# Altium schematic sheet Interface.SchDoc: Interface
size A3; Organization: Hofmann Travel; SheetNumber: 4; SheetTotal: 10
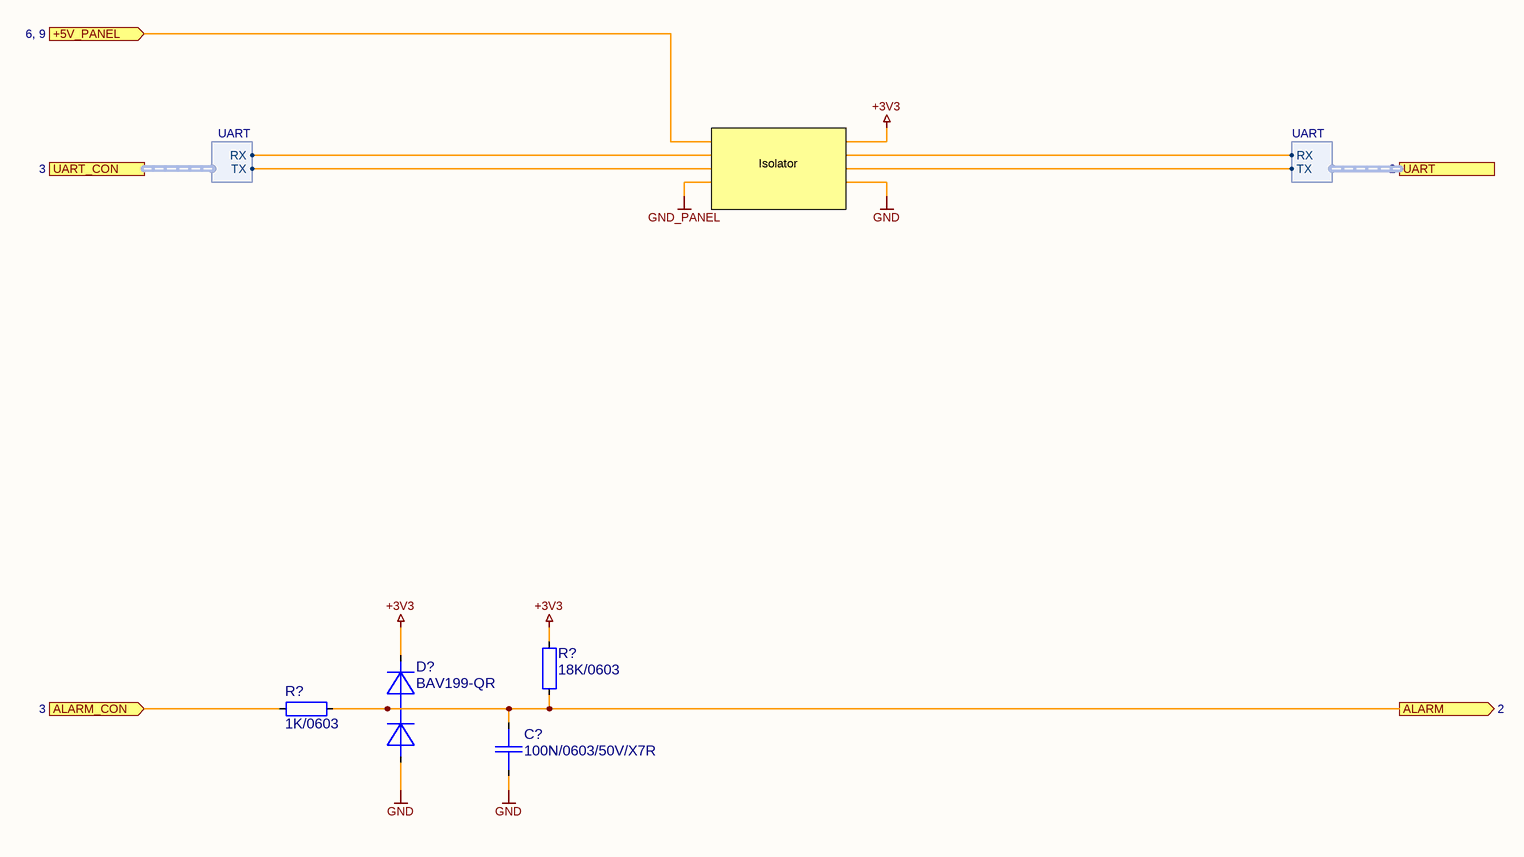
[diagram p0: Interface.SchDoc]

## Parts
(Parts that share a designator on the sheet are numbered #1, #2 ... from top to bottom, then left to right.)
C?  100N/0603/50V/X7R  [CAP0603_X7R]
D?  BAV199-QR  [SOT2395P280X125-3-SE]
R?#1  18K/0603  [R0603-0.40-WW]
R?#2  1K/0603  [R0603-0.40-WW]

## Ports
+5V_PANEL (in, see 6, 9), ALARM (out, see 2), ALARM_CON (in, see 3), UART (harness UART, see 2), UART_CON (harness UART, see 3)

## Harnesses
UART: RX, TX

## Nets
+3V3: D?.2(K2) R?#1.1
GND: C?.2 D?.1(A1)
ALARM: C?.1 D?.3(K1/A2) R?#1.2 R?#2.2 ; port ALARM
ALARM_CON: R?#2.1 ; port ALARM_CON

## Notes on the sheet
- Isolator
- Date:
- Size:
- A3
- Schema:
- Layout:

## Library data of the parts
C? = 100N/0603/50V/X7R: CAP SM 0603 100nF 50V X7R; Manufacturer: GENERIC; Manufacturer 1: YAGEO; Manufacturer Part Number 1: CC0603KPX7R9BB104; Absolute Value: 1E-7; Eurocircuits GPN: GPC0603104; Part Number: 100N/0603/50V/X7R; Package: 0603; Value: 100nF; HelpURL: https://www.yageo.com/upload/media/product/app/datasheet/mlcc/upy-gphc_x7r_6_3v-to-250v.pdf; Supplier 1: Digi-Key; Supplier Part Number 1: 311-3567-1-ND; Manufacturer 2: YAGEO; Manufacturer Part Number 2: CC0603MRX7R9BB104; Supplier 2: Digi-Key; Supplier Part Number 2: 311-4110-1-ND; Supplier 3: LCSC; Supplier Part Number 3: C14663; JLC Type: Basic
D? = BAV199-QR: Low-leakage double diode; Manufacturer: Nexperia USA Inc.; Absolute Value: 75V; Part Number: BAV199-QR; Package: SOT23; Value: BAV199-QR; HelpURL: https://assets.nexperia.com/documents/data-sheet/BAV199-Q.pdf; Manufacturer 1: Nexperia USA Inc.; Manufacturer Part Number 1: BAV199-QR; Supplier 1: Digikey; Supplier Part Number 1: 1727-BAV199-QRCT-ND; Manufacturer 3: Jiangsu Changjing Electronics Technology Co., Ltd.; Manufacturer Part Number 3: BAV199; Supplier 3: LCSC; Supplier Part Number 3: C68971
R?#1 = 18K/0603: RES SM 0603 18K; Manufacturer: GENERIC; Manufacturer 1: YAGEO; Manufacturer Part Number 1: RC0603FR-1318KL; Absolute Value: 18000; Eurocircuits GPN: GPR060318K; Part Number: 18K/0603; Package: 0603; Value: 18K; HelpURL: https://www.yageo.com/upload/media/product/productsearch/datasheet/rchip/PYu-RC_Group_51_RoHS_L_12.pdf; Supplier 1: Digi-Key; Supplier Part Number 1: 13-RC0603FR-1318KLCT-ND; Manufacturer 2: YAGEO; Manufacturer Part Number 2: RC0603FR-1018KL; Supplier 2: Digi-Key; Supplier Part Number 2: 13-RC0603FR-1018KLCT-ND
R?#2 = 1K/0603: RES SM 0603 1K; Manufacturer: GENERIC; Manufacturer 1: YAGEO; Manufacturer Part Number 1: RC0603FR-131KL; Absolute Value: 1000; Eurocircuits GPN: GPR06031K; Part Number: 1K/0603; Package: 0603; Value: 1K; HelpURL: https://www.yageo.com/upload/media/product/app/datasheet/rchip/pyu-rc_group_51_rohs_l.pdf; Supplier 1: Digi-Key; Supplier Part Number 1: 13-RC0603FR-131KLCT-ND; Manufacturer 2: YAGEO; Manufacturer Part Number 2: RC0603FR-101KL; Supplier 2: Digi-Key; Supplier Part Number 2: 13-RC0603FR-101KLCT-ND; Manufacturer 3: UNI-ROYAL(Uniroyal Elec); Manufacturer Part Number 3: 0603WAF1001T5E; Supplier 3: LCSC; Supplier Part Number 3: C21190; JLC Type: Basic